# Altium schematic sheet InverterConnector.SchDoc: Inverter Connector
size Letter; Engineer: Nathan Petersen; DocumentNumber: 17; Revision: v1.2; SheetNumber: 17; SheetTotal: 23
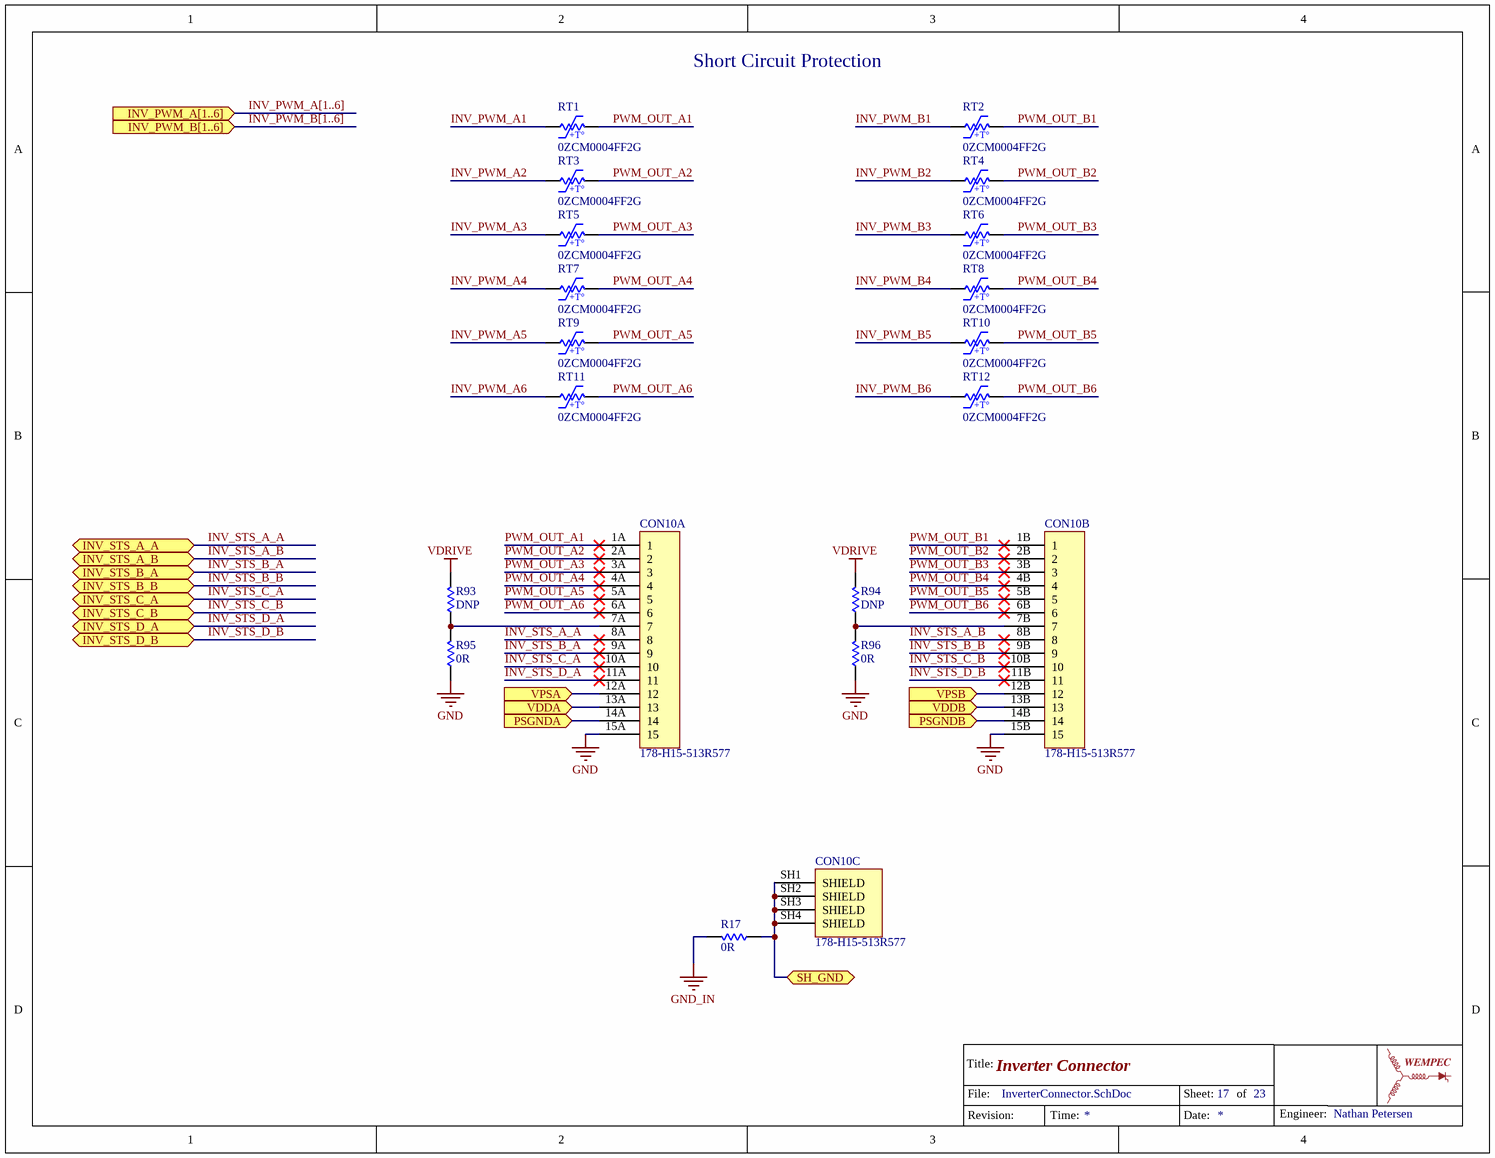
[diagram p0: InverterConnector.SchDoc]

## Parts
CON10  178-H15-513R577  [178-H15-513R577]  (parts A,B,C of 3)
R17  value 0R  [1206-RES]  (hidden comment: Resistor)
R93  value DNP  [1206-RES]  (hidden comment: Resistor)
R94  value DNP  [1206-RES]  (hidden comment: Resistor)
R95  value 0R  [1206-RES]  (hidden comment: Resistor)
R96  value 0R  [1206-RES]  (hidden comment: Resistor)
RT1  0ZCM0004FF2G  [PTCC1607X06N]
RT2  0ZCM0004FF2G  [PTCC1607X06N]
RT3  0ZCM0004FF2G  [PTCC1607X06N]
RT4  0ZCM0004FF2G  [PTCC1607X06N]
RT5  0ZCM0004FF2G  [PTCC1607X06N]
RT6  0ZCM0004FF2G  [PTCC1607X06N]
RT7  0ZCM0004FF2G  [PTCC1607X06N]
RT8  0ZCM0004FF2G  [PTCC1607X06N]
RT9  0ZCM0004FF2G  [PTCC1607X06N]
RT10  0ZCM0004FF2G  [PTCC1607X06N]
RT11  0ZCM0004FF2G  [PTCC1607X06N]
RT12  0ZCM0004FF2G  [PTCC1607X06N]

## Ports
INV_PWM_A[1..6] (in), INV_PWM_B[1..6] (in), INV_STS_A_A (bidir), INV_STS_A_B (bidir), INV_STS_B_A (bidir), INV_STS_B_B (bidir), INV_STS_C_A (bidir), INV_STS_C_B (bidir), INV_STS_D_A (bidir), INV_STS_D_B (bidir), PSGNDA (in), PSGNDB (in), SH_GND (bidir), VDDA (in), VDDB (in), VPSA (in), VPSB (in)

## Nets
GND: CON10.15A(15) CON10.15B(15) R95.1 R96.1
GND_IN: R17.2
VDRIVE: R93.2 R94.2
INV_PWM_A1: RT1.1
INV_PWM_A2: RT3.1
INV_PWM_A3: RT5.1
INV_PWM_A4: RT7.1
INV_PWM_A5: RT9.1
INV_PWM_A6: RT11.1
INV_PWM_B1: RT2.1
INV_PWM_B2: RT4.1
INV_PWM_B3: RT6.1
INV_PWM_B4: RT8.1
INV_PWM_B5: RT10.1
INV_PWM_B6: RT12.1
INV_STS_A_A: CON10.8A(8) ; port INV_STS_A_A
INV_STS_A_B: CON10.8B(8) ; port INV_STS_A_B
INV_STS_B_A: CON10.9A(9) ; port INV_STS_B_A
INV_STS_B_B: CON10.9B(9) ; port INV_STS_B_B
INV_STS_C_A: CON10.10A(10) ; port INV_STS_C_A
INV_STS_C_B: CON10.10B(10) ; port INV_STS_C_B
INV_STS_D_A: CON10.11A(11) ; port INV_STS_D_A
INV_STS_D_B: CON10.11B(11) ; port INV_STS_D_B
PSGNDA: CON10.14A(14) ; port PSGNDA
PSGNDB: CON10.14B(14) ; port PSGNDB
PWM_OUT_A1: CON10.1A(1) RT1.2
PWM_OUT_A2: CON10.2A(2) RT3.2
PWM_OUT_A3: CON10.3A(3) RT5.2
PWM_OUT_A4: CON10.4A(4) RT7.2
PWM_OUT_A5: CON10.5A(5) RT9.2
PWM_OUT_A6: CON10.6A(6) RT11.2
PWM_OUT_B1: CON10.1B(1) RT2.2
PWM_OUT_B2: CON10.2B(2) RT4.2
PWM_OUT_B3: CON10.3B(3) RT6.2
PWM_OUT_B4: CON10.4B(4) RT8.2
PWM_OUT_B5: CON10.5B(5) RT10.2
PWM_OUT_B6: CON10.6B(6) RT12.2
SH_GND: CON10.SH1(SHIELD) CON10.SH2(SHIELD) CON10.SH3(SHIELD) CON10.SH4(SHIELD) R17.1 ; port SH_GND
VDDA: CON10.13A(13) ; port VDDA
VDDB: CON10.13B(13) ; port VDDB
VPSA: CON10.12A(12) ; port VPSA
VPSB: CON10.12B(12) ; port VPSB
NetCON10_7A: CON10.7A(7) R93.1 R95.2
NetCON10_7B: CON10.7B(7) R94.1 R96.2

## Buses and harness runs
bus INV_PWM_A[1..6] = port INV_PWM_A[1..6]
bus INV_PWM_B[1..6] = port INV_PWM_B[1..6]

## Notes on the sheet
- Short Circuit Protection
- Title:
- File:
- Sheet:
- of
- Revision:
- Time:
- Date:
- Engineer:
- (in symbol 0ZCM0004FF2G) +T°

## Library data of the parts
CON10 = 178-H15-513R577: CONN D-SUB PLUG 15POS R/A SLDR; Supplier 1: Digi-Key; Supplier Part Number 1: NOR1831-ND
RT1-RT12 = 0ZCM0004FF2G: PTC RESET FUSE 24V 40MA 0603; Supplier 1: Digi-Key; Supplier Part Number 1: 507-0ZCM0004FF2GCT-ND
R17 R93-R96 = Resistor: Supplier 1: Digi-Key; Supplier Part Number 1: 311-0.0ERCT-ND